# EAGLE schematic Display connection (EAGLE 9.6.2)
By Bruno Pasquini
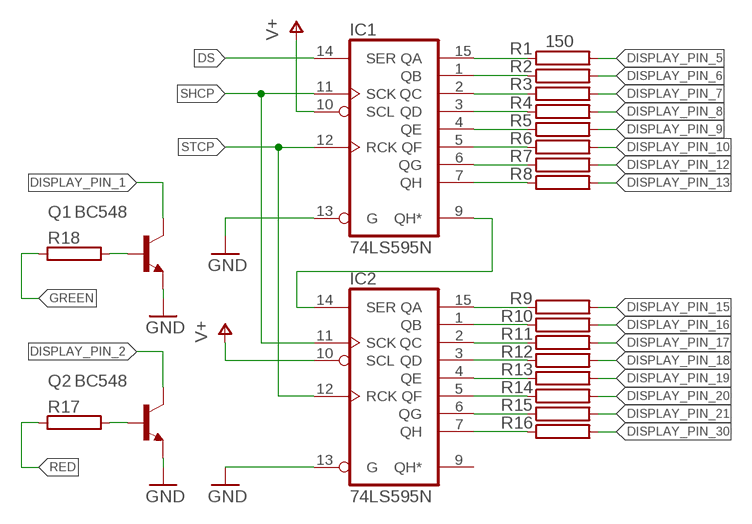
[diagram p0: schematic, sheet 1]

## Parts
IC1  74LS595N  [DIL16]
IC2  74LS595N  [DIL16]
Q1  BC548  [TO92-EBC]
Q2  BC548  [TO92-EBC]
R1  150  RCA0002  [CA0002]
R2  RCA0002  [CA0002]
R3  RCA0002  [CA0002]
R4  RCA0002  [CA0002]
R5  RCA0002  [CA0002]
R6  RCA0002  [CA0002]
R7  RCA0002  [CA0002]
R8  RCA0002  [CA0002]
R9  RCA0002  [CA0002]
R10  RCA0002  [CA0002]
R11  RCA0002  [CA0002]
R12  RCA0002  [CA0002]
R13  RCA0002  [CA0002]
R14  RCA0002  [CA0002]
R15  RCA0002  [CA0002]
R16  RCA0002  [CA0002]
R17  RCA0002  [CA0002]
R18  RCA0002  [CA0002]

## Nets
DISPLAY_PIN_1: Q1.C
DISPLAY_PIN_2: Q2.C
DISPLAY_PIN_5: R1.2
DISPLAY_PIN_6: R2.2
DISPLAY_PIN_7: R3.2
DISPLAY_PIN_8: R4.2
DISPLAY_PIN_9: R5.2
DISPLAY_PIN_10: R6.2
DISPLAY_PIN_12: R7.2
DISPLAY_PIN_13: R8.2
DISPLAY_PIN_15: R9.2
DISPLAY_PIN_16: R10.2
DISPLAY_PIN_17: R11.2
DISPLAY_PIN_18: R12.2
DISPLAY_PIN_19: R13.2
DISPLAY_PIN_20: R14.2
DISPLAY_PIN_21: R15.2
DISPLAY_PIN_30: R16.2
DS: IC1.14(SER)
GND: IC1.13(G) IC2.13(G) Q1.E Q2.E
GREEN: R18.1
N$1: IC1.15(QA) R1.1
N$2: IC1.1(QB) R2.1
N$3: IC1.2(QC) R3.1
N$4: IC1.3(QD) R4.1
N$5: IC1.4(QE) R5.1
N$6: IC1.5(QF) R6.1
N$7: IC1.6(QG) R7.1
N$8: IC1.7(QH) R8.1
N$9: IC2.15(QA) R9.1
N$10: IC2.1(QB) R10.1
N$11: IC2.2(QC) R11.1
N$12: IC2.3(QD) R12.1
N$13: IC2.4(QE) R13.1
N$14: IC2.5(QF) R14.1
N$15: IC2.6(QG) R15.1
N$16: IC2.7(QH) R16.1
N$17: Q1.B R18.2
N$18: Q2.B R17.2
N$19: IC1.9(QH*) IC2.14(SER)
RED: R17.1
SHCP: IC1.11(SCK) IC2.11(SCK)
STCP: IC1.12(RCK) IC2.12(RCK)
V+: IC1.10(SCL) IC2.10(SCL)
Unconnected: IC2.9(QH*)

## Power pins joined to a net without a drawn wire
GND: IC1.8(GND) IC2.8(GND)
VCC: IC1.16(VCC) IC2.16(VCC)

## Library data of the parts
IC1 IC2 = 74xx-us:74*595: 8-bit SHIFT REGISTER, output latch
Q1 Q2 = transistor-npn:BC548*: NPN Transistor
R1-R18 = resistor-power:R: Power Resitor; OC_FARNELL: unknown; OC_NEWARK: unknown